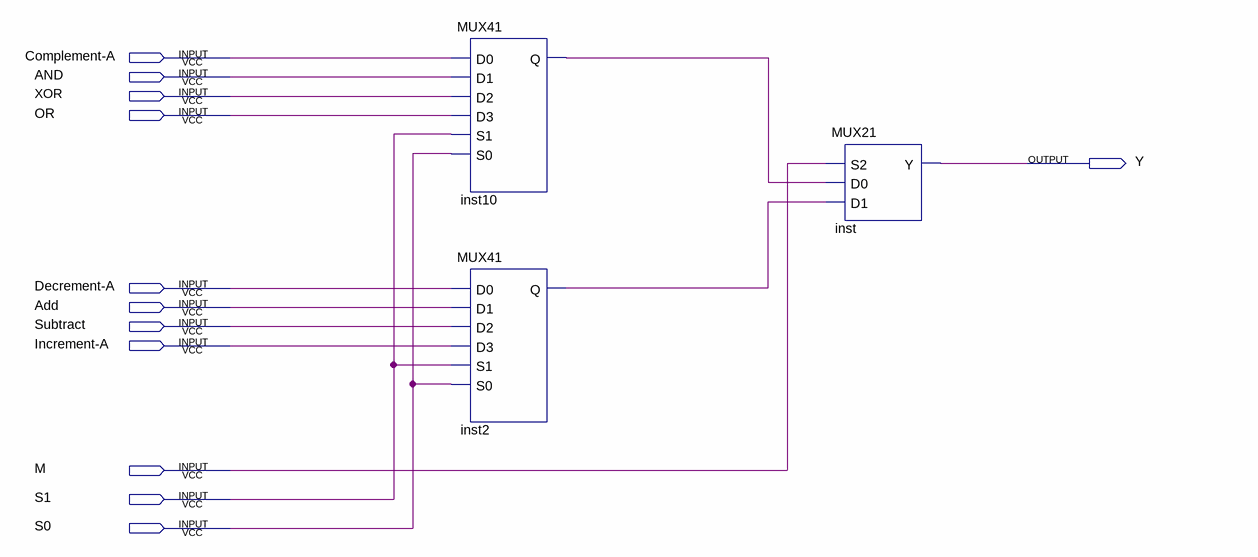
[diagram p0: schematic sheet]
// Quartus schematic MUX81.bdf as structural Verilog: 3 symbols, 12 pins
module MUX81 (
  input  \Complement-A ,
  input  AND,
  input  XOR,
  input  OR,
  input  \Decrement-A ,
  input  Add,
  input  Subtract,
  input  \Increment-A ,
  input  M,
  input  S1,
  input  S0,
  output Y
);

  wire inst2_q, inst10_q;

  MUX41 inst10 (.D0(\Complement-A ), .D1(AND), .D2(XOR), .D3(OR), .S1(S1), .S0(S0), .Q(inst10_q));
  MUX41 inst2 (.D0(\Decrement-A ), .D1(Add), .D2(Subtract), .D3(\Increment-A ), .S1(S1), .S0(S0), .Q(inst2_q));
  MUX21 inst (.S2(M), .D0(inst10_q), .D1(inst2_q), .Y(Y));
endmodule
